# Altium schematic sheet Starboard Depoyable 2U.SchDoc: Starboard Deployable 2U
size Letter; Author: Nicholas J. Sorensen; DocumentNumber: 1; SheetNumber: 1; SheetTotal: 8; CopyrightYear: 2019
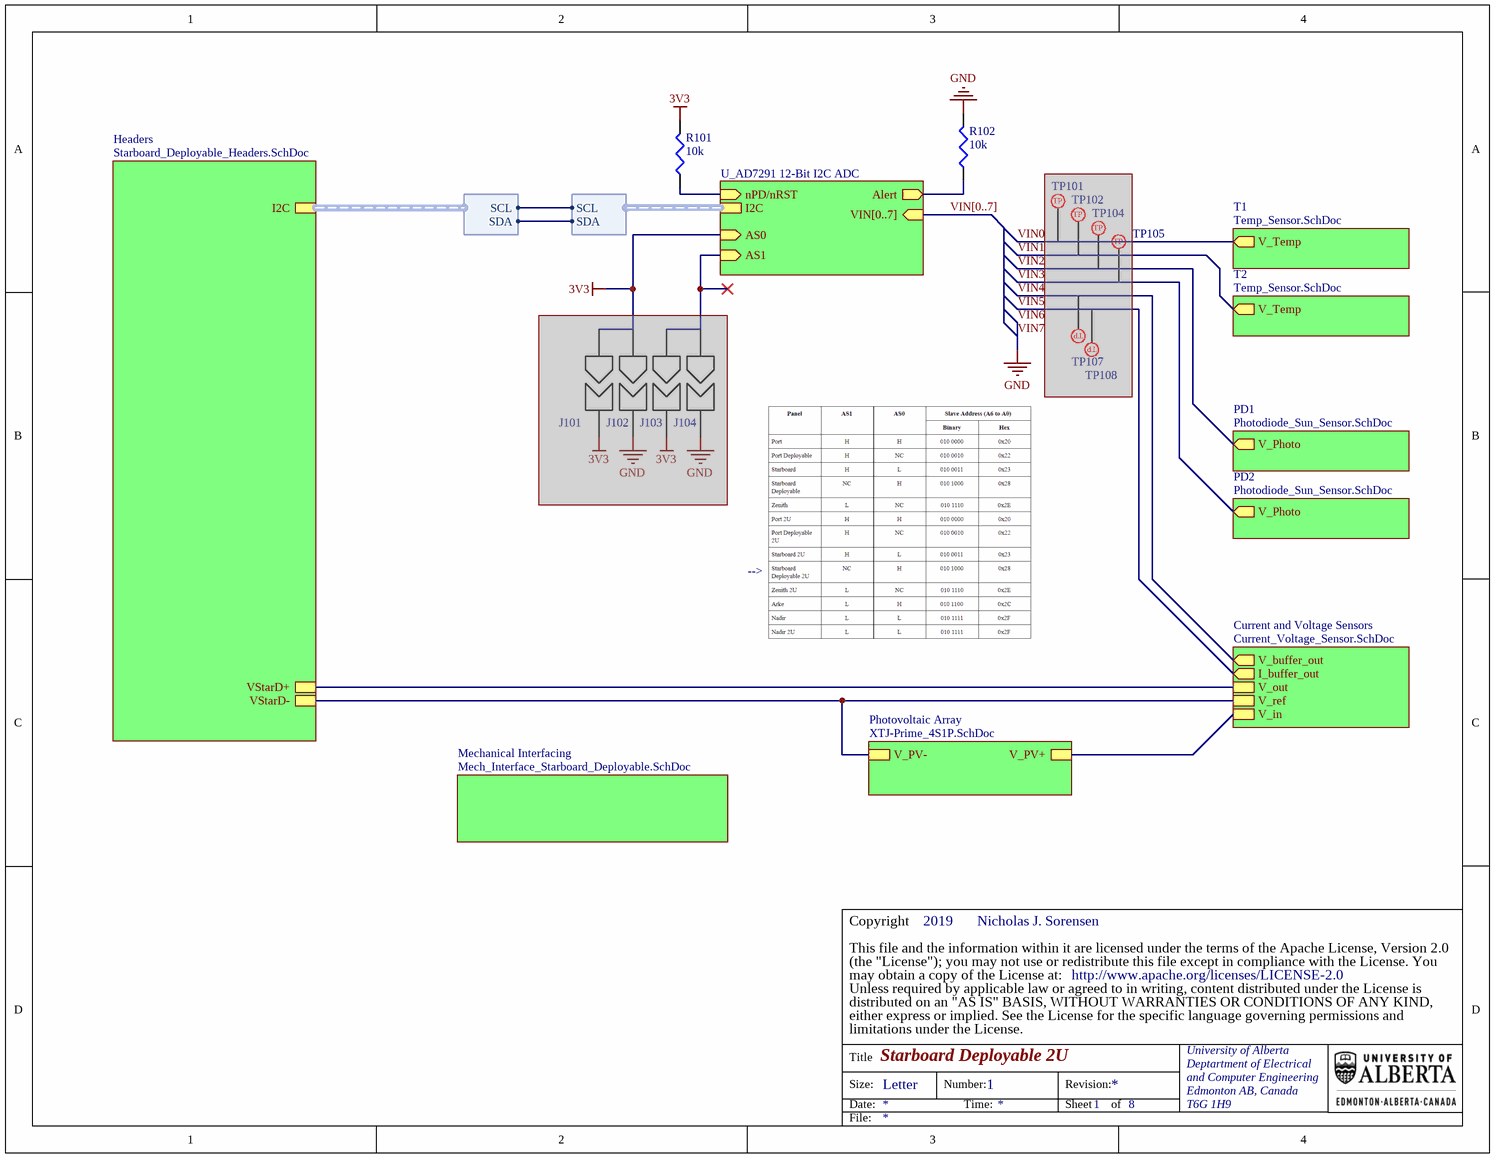
[diagram p0: Starboard Depoyable 2U.SchDoc]

## Parts
J101  Jumping Pad  [Jumping Pad]  (value not drawn)  (masked out: inside a compile mask, not in the netlist)
J102  Jumping Pad  [Jumping Pad]  (value not drawn)  (masked out: inside a compile mask, not in the netlist)
J103  Jumping Pad  [Jumping Pad]  (value not drawn)  (masked out: inside a compile mask, not in the netlist)
J104  Jumping Pad  [Jumping Pad]  (value not drawn)  (masked out: inside a compile mask, not in the netlist)
R101  value 10k  [VSH-0603MCT]  (hidden comment: Res3)
R102  value 10k  [VSH-0603MCT]  (hidden comment: Res3)
TP101  5017  [KS-5017]  (value not drawn)  (masked out: inside a compile mask, not in the netlist)
TP102  5017  [KS-5017]  (value not drawn)  (masked out: inside a compile mask, not in the netlist)
TP104  5017  [KS-5017]  (value not drawn)  (masked out: inside a compile mask, not in the netlist)
TP105  5017  [KS-5017]  (value not drawn)  (masked out: inside a compile mask, not in the netlist)
TP107  5017  [KS-5017]  (value not drawn)  (masked out: inside a compile mask, not in the netlist)
TP108  5017  [KS-5017]  (value not drawn)  (masked out: inside a compile mask, not in the netlist)

## Sub-sheets
Current and Voltage Sensors = Current_Voltage_Sensor.SchDoc: V_out, V_ref, V_in, I_buffer_out (out), V_buffer_out (out)
Headers = Starboard_Deployable_Headers.SchDoc: I2C (harness I2C), VStarD+, VStarD-
Mechanical Interfacing = Mech_Interface_Starboard_Deployable.SchDoc: no entries
PD1 = Photodiode_Sun_Sensor.SchDoc: V_Photo (out)
PD2 = Photodiode_Sun_Sensor.SchDoc: V_Photo (out)
Photovoltaic Array = XTJ-Prime_4S1P.SchDoc: V_PV+, V_PV-
T1 = Temp_Sensor.SchDoc: V_Temp (out)
T2 = Temp_Sensor.SchDoc: V_Temp (out)
U_AD7291 12-Bit I2C ADC = AD7291 12-Bit I2C ADC.SchDoc: nPD/nRST (in), Alert (out), VIN[0..7] (in), AS0 (in), AS1 (in), I2C (harness I2C)

## Harnesses
I2C: SCL, SDA

## Nets
3V3: R101.2 ; sheet U_AD7291 12-Bit I2C ADC/AS0
VIN6: R102.2  [also labelled GND, VIN7]
VIN0: sheet T1/V_Temp
VIN1: sheet T2/V_Temp
VIN2: sheet PD1/V_Photo
VIN3: sheet PD2/V_Photo
VIN4: sheet Current and Voltage Sensors/V_buffer_out
VIN5: sheet Current and Voltage Sensors/I_buffer_out
NetR101_1: R101.1 ; sheet U_AD7291 12-Bit I2C ADC/nPD/nRST
NetR102_1: R102.1 ; sheet U_AD7291 12-Bit I2C ADC/Alert
(unnamed): sheet Photovoltaic Array/V_PV+, sheet Current and Voltage Sensors/V_in
(unnamed): sheet Photovoltaic Array/V_PV-, sheet Current and Voltage Sensors/V_ref, sheet Headers/VStarD-
(unnamed): sheet Current and Voltage Sensors/V_out, sheet Headers/VStarD+
(unnamed): sheet U_AD7291 12-Bit I2C ADC/I2C.SCL, sheet Headers/I2C.SCL
(unnamed): sheet U_AD7291 12-Bit I2C ADC/I2C.SDA, sheet Headers/I2C.SDA

## Buses and harness runs
bus VIN[0..7] = sheet U_AD7291 12-Bit I2C ADC/VIN[0..7]

## Notes on the sheet
- -->
- (the "License"); you may not use or redistribute this file except in compliance with the License. You
- This file and the information within it are licensed under the terms of the Apache License, Version 2.0
- Copyright
- Unless required by applicable law or agreed to in writing, content distributed under the License is
- distributed on an "AS IS" BASIS, WITHOUT WARRANTIES OR CONDITIONS OF ANY KIND,
- either express or implied. See the License for the specific language governing permissions and
- limitations under the License.
- may obtain a copy of the License at:
- http://www.apache.org/licenses/LICENSE-2.0
- Title
- Size:
- Date:
- Letter
- Number:
- Time:
- Revision:
- Sheet
- of
- University of Alberta
- Deptartment of Electrical
- and Computer Engineering
- Edmonton AB, Canada
- T6G 1H9
- File:
- (in symbol PTP-KS-00001) TP

## Library data of the parts
J101-J104 = PXX-ABS-00011: Manufacturer Part Number: Custom; Index: 11; Designator: J?; Part Number: PXX-ABS-00011; Supplier 1: Digi-key; Publisher: AlbertaSat; LatestRevisionNote: ...
R101 R102 = PR-VSH-00143: RES SMD 10K OHM 1% 1/8W 0603; Manufacturer Part Number: MCT06030C1002FP500; Index: 143; Designator: R?; Temperature Coefficient: ±50ppm/°C; Published: 3/14/2016; LatestRevisionDate: 3/14/2016; LatestRevisionNote: ...; PackageReference: 0603 (1608 Metric); Publisher: AlbertaSat; PackageDescription: Chip Resistor, 2-Leads, Body 1.55x0.85mm, IPC Low Density; Part Number: PR-VSH-00143; Supplier Part Number 1: MCT0603-10.0K-CFCT-ND; Supplier 1: Digi-key; Supplier Link: http://www.digikey.ca/product-search/en?keywords=MCT0603-10.0K-CFCT-ND; Tolerance: ±1%; Power - Rated: 1/8W; Applications: General Purpose
TP101 TP102 TP104 TP105 TP107 TP108 = PTP-KS-00001: PC TEST POINT MINI SMD; Index: 1; Supplier 1: Digi-key; Supplier 2: Newark; Supplier 3: Mouser; Part Number: PTP-KS-00001; Manufacturer Part Number: 5017; Supplier Part Number 1: 36-5017CT-ND; Publisher: AlbertaSat; Published: 3/15/2016; LatestRevisionDate: 3/15/2016; LatestRevisionNote: ...; PackageReference: KS-5017; PackageDescription: Testpoint Lug Mini SMD 27X10X152; Supplier Link: http://www.digikey.ca/product-detail/en/keystone-electronics/5017/36-5017TR-ND/2217304